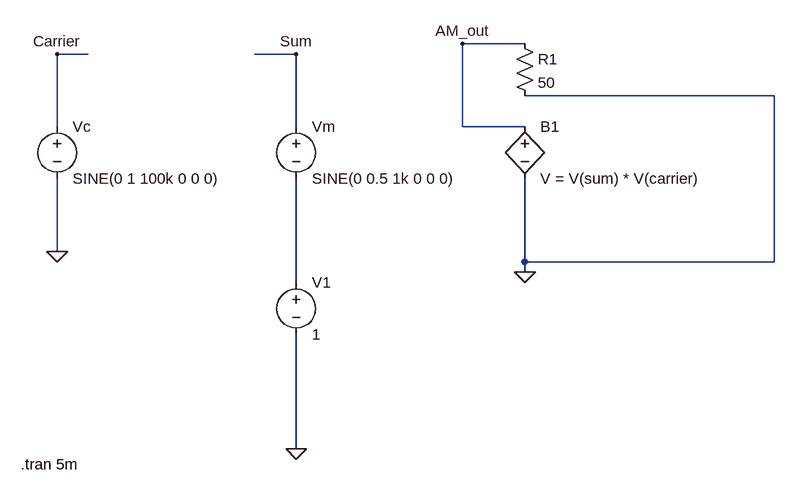
[diagram p0: schematic AM-Signal (exp 9).asc]
AM-Signal (exp 9).asc, the LTspice schematic file:
Version 4.1
SHEET 1 1172 680
WIRE 784 -48 688 -48
WIRE 112 -32 64 -32
WIRE 432 -32 368 -32
WIRE 1168 32 784 32
WIRE 64 80 64 -32
WIRE 432 80 432 -32
WIRE 688 80 688 -48
WIRE 784 80 688 80
WIRE 64 272 64 160
WIRE 784 288 784 160
WIRE 1168 288 1168 32
WIRE 1168 288 784 288
WIRE 784 304 784 288
WIRE 432 320 432 160
WIRE 432 576 432 400
FLAG 64 272 0
FLAG 64 -32 Carrier
FLAG 432 576 0
FLAG 432 -32 Sum
FLAG 688 -48 AM_out
FLAG 784 304 0
SYMBOL voltage 64 64 R0
WINDOW 123 0 0 Left 0
WINDOW 39 0 0 Left 0
SYMATTR InstName Vc
SYMATTR Value SINE(0 1 100k 0 0 0)
SYMBOL voltage 432 64 R0
WINDOW 123 0 0 Left 0
WINDOW 39 0 0 Left 0
SYMATTR InstName Vm
SYMATTR Value SINE(0 0.5 1k 0 0 0)
SYMBOL voltage 432 304 R0
WINDOW 123 0 0 Left 0
WINDOW 39 0 0 Left 0
SYMATTR InstName V1
SYMATTR Value 1
SYMBOL bv 784 64 R0
SYMATTR InstName B1
SYMATTR Value V = V(sum) * V(carrier)
SYMBOL res 768 -64 R0
SYMATTR InstName R1
SYMATTR Value 50
TEXT 8 600 Left 2 !.tran 5m

The netlist it stands for:
* AM-Signal (exp 9).asc
Vc Carrier 0 SINE(0 1 100k 0 0 0)
Vm Sum N001 SINE(0 0.5 1k 0 0 0)
V1 N001 0 1
B1 AM_out 0 V = V(sum) * V(carrier)
R1 AM_out 0 50
.tran 5m
.backanno
.end